# EAGLE design twometertx (EAGLE 7.3.0)
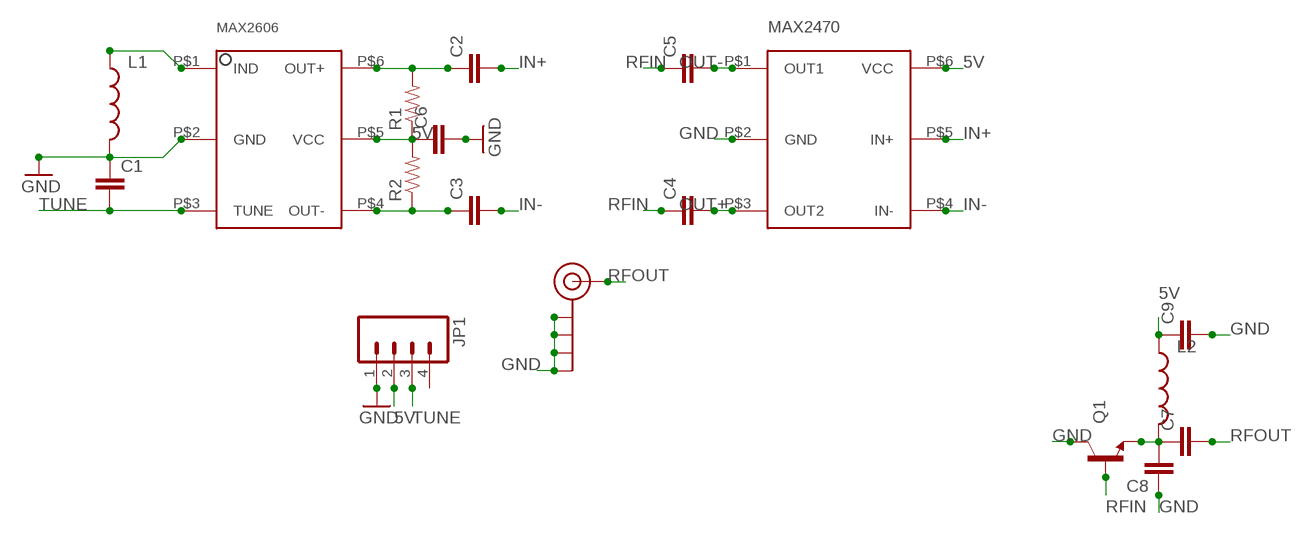
[diagram p0: schematic, sheet 1]

## Parts
C1  CAP0805  [0805]
C2  CAP0805  [0805]
C3  CAP0805  [0805]
C4  CAP0805  [0805]
C5  CAP0805  [0805]
C6  CAP0805  [0805]
C7  CAP0805  [0805]
C8  CAP0805  [0805]
C9  CAP0805  [0805]
J$1  SMA_EDGE  [SMA-EDGE]
JP1  M04LONGPADS  [1X04_LONGPADS]
L1  INDUCTOR0805  [0805]
L2  INDUCTOR0805  [0805]
Q1  TRANSISTOR_NPNSOT89  [SOT89]
R1  RESISTOR0805-RES  [0805]
R2  RESISTOR0805-RES  [0805]
U$1  MAX2606  [MAX2606]
U$2  MAX2470  [MAX2470]

## Nets
5V: C6.1 C9.1 JP1.2 L2.1 R1.1 R2.2 U$1.P$5(VCC) U$2.P$6(VCC)
GND: C1.1 C6.2 C8.1 C9.2 J$1.GND@0(GND) J$1.GND@1(GND) J$1.GND@2(GND) J$1.GND@3(GND) JP1.1 L1.2 Q1.2(C) U$1.P$2(GND) U$2.P$2(GND)
IN+: C2.2 U$2.P$5(IN+)
IN-: C3.2 U$2.P$4(IN-)
N$2: L1.1 U$1.P$1(IND)
N$3: C7.1 C8.2 L2.2 Q1.3(E)
OUT+: C4.2 U$2.P$3(OUT2)
OUT-: C5.2 U$2.P$1(OUT1)
RFIN: C4.1 C5.1 Q1.1(B)
RFOUT: C7.2 J$1.SIG(SIGNAL)
THING: C2.1 R1.2 U$1.P$6(OUT+)
THING2: C3.1 R2.1 U$1.P$4(OUT-)
TUNE: C1.2 JP1.3 U$1.P$3(TUNE)
Unconnected: JP1.4

## Library data of the parts
C1-C9 = SparkFun-Capacitors:CAP: Capacitor Standard 0603 ceramic capacitor, and 0.1" leaded capacitor.
J$1 = SparkFun-Connectors:SMA_EDGE: SMA Antenna Connector End launch SMA connector. The paste layer has been removed so that the connector can be hand soldered onto the board after reflow.
JP1 = SparkFun-Connectors:M04: Header 4 Standard 4-pin 0.1" header. Use with straight break away headers (SKU : PRT-00116), right angle break away headers (PRT-00553), swiss pins (PRT-00743), machine pins (PRT-00117), and female headers (PRT-00115). Molex polarized connector foot print use with SKU : PRT-08231 with associated crimp pins and housings. 1MM SMD Version SKU: PRT-10208
L1 L2 = SparkFun-Passives:INDUCTOR: Inductors Basic Inductor/Choke - 0603 and 1206. Footprints are not proven and vary greatly between part numbers. SRN6045- 33uH, 20% 1.4A SDR0403-560KL - 56uH, 10%, 500mA RMS/740mA peak
Q1 = SparkFun-DiscreteSemi:TRANSISTOR_NPN: Generic NPN BJT MMBT2222A - TRANS-08049 (SOT-23, 1A 40V) MPSA42 - TRANS-09116 (SOT-23, 500mA 300V) MMBT5088LT1G - TRANS-11160 (SOT-23, 50 mA 30V) BC547 - COM-08928 <http://www.sparkfun.com/products/8928> (TO-92 45V 100mA) (1.Collector 2.Base 3.Emitter) 2N3904 - COM-00521 <http://www.sparkfun.com/products/521> (TO-92 40V 200mA) (1.Emitter 2.Base 3.Collector) P2N2222A - COM-12852 <http://www.sparkfun.com/products/12852> (TO-92 40V 600mA) (1.Collector 2.Base 3.Emitter)
R1 R2 = SparkFun-Passives:RESISTOR: Resistor Basic schematic elements and footprints for 0603, 1206, and PTH resistors.
U$1 = MAX2606:MAX2606: MAX2606 RF transmitter in SOT 23-6 package
U$2 = MAX2470:MAX2470

## Board
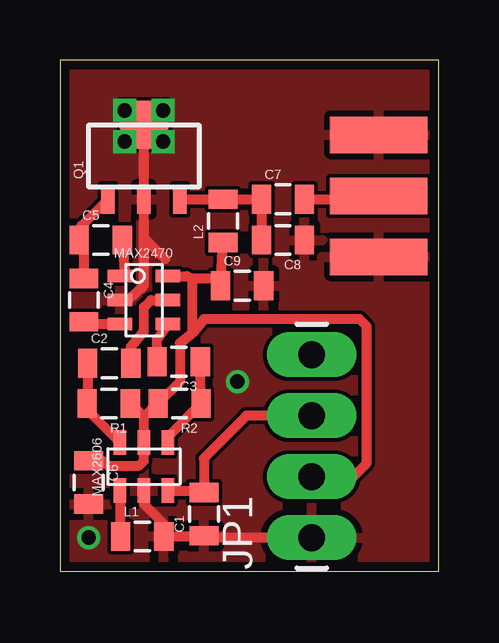
[diagram p1: board, top side]
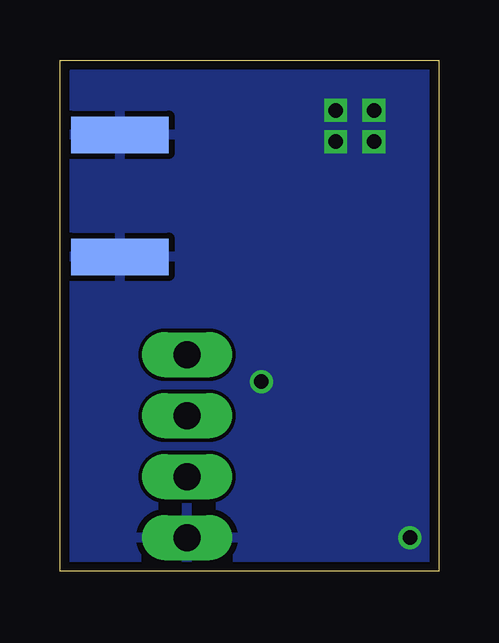
[diagram p2: board, bottom side, seen from below]

Size 15.8 x 21.3 mm. Coordinates in mm from the lower left corner, seen from the top.
Outline: 0,0 15.8,0 15.8,21.3 0,21.3 0,0
Copper layers (1*16): Top 0.0356mm / dielectric 1.5011mm / Bottom 0.0356mm
Design rules "oshpark-2layer": minimum track width 6mil, minimum drill 13mil, track to track 6mil, track to pad 6mil, pad to pad 6mil, via to via 6mil, smd to smd 6mil, copper to edge 15mil, drill to drill 6mil, minimum pad ring 7mil, minimum via ring 7mil, stop-mask expansion 4mil, vias tented up to drill 0mil, thermal gap 10mil

### Footprints (pad centres in the part's own frame; a part is rotated, then mirrored left to right if it is on the bottom)
0805 = smd 0.8 x 1.2: 1 -0.9,0; 2 0.9,0
SMA-EDGE = smd 1.524 x 4.064: GND@0 0,0; GND@1 5.08,0; SIG 2.54,0 | smd 1.524 x 4.064 bottom: GND@2 0,0; GND@3 5.08,0
1X04_LONGPADS = drill 1.118 pad 1.88 long: 1 0,0; 2 2.54,0; 3 5.08,0; 4 7.62,0
SOT89 = smd 0.58 x 1.2: 1 -1.5,-1.8; 2 0,-1.8; 3 1.5,-1.8 | smd 2 x 2: 4 0,1.3
MAX2606 = smd 0.508 x 1.016: P$1 -1,-1; P$2 0,-1; P$3 1,-1; P$4 1,1; P$5 0,1; P$6 -1,1
MAX2470 = smd 0.508 x 1.016: P$1 -1,-1; P$2 0,-1; P$3 1,-1; P$4 1,1; P$5 0,1; P$6 -1,1

### Placement (x,y rotation side)
C1  6.01,2.38 90 top
C2  2.06,8.67 0 top
C3  4.95,8.73 180 top
C4  1,11.3 270 top
C5  1.7,13.8 0 top
C6  1.2,3.7 270 top
C7  9.3,15.5 0 top
C8  9.3,13.8 180 top
C9  7.6,11.9 0 top
J$1  13.3,13.1 90 top
JP1  10.5,1.4 90 top
L1  3.43,1.45 0 top
L2  6.8,14.6 90 top
Q1  3.5,17.3 0 top
R1  2.04,6.99 180 top
R2  4.99,6.99 180 top
U$1  3.5,4.36 0 top
U$2  3.5,11.3 270 top

### Tracks (layer width: path | path; a pad name or v marks a point on that pad's centre or on a via)
5V
  Top 0.406: 3.5,6.43 U$1.P$5 3.5,4.6 3.3,4.4 2,4.4 1.8,4.6 C6.1 | 3.5,6.43 R1.1 | 3.5,6.43 4.06,6.99 R2.2 5,7.9 5,9.5 5.5,9.9 | U$2.P$6 5.3,12.3 5.5,12.2 | 5.5,12.2 5.5,9.9 | JP1.2 12.24,3.94 12.8,4.5 12.8,10.2 12.5,10.5 6,10.5 5.5,9.9 | 5.5,12.2 6.4,12.2 C9.1 L2.1
GND  (via drill 0.6)
  Top 0.406: U$1.P$2 3.5,2.8 4.3,2 4.3,1.48 L1.2 5.98,1.45 C1.1 6.09,1.4 JP1.1 | U$2.P$2 2.8,11.3 3.5,11.9 3.5,13.9 | 3.5,13.9 Q1.2 3.5,17.7 3.8,18 | 4.4,13 3.5,13.9
  other vias: 2.7,19.2 4.3,19.2 4.3,17.9 2.7,17.9 7.4,7.9 1.2,1.4
  pour Bottom: -2.6,20.8 15.2,20.8 15.2,-2.3 -2.6,-2.3
  pour Top: -2.7,20.8 15.2,20.8 15.2,-2.3 -2.7,-2.3
IN+
  Top 0.406: C2.2 2.96,9.36 3.5,10 3.5,11 3.8,11.3 U$2.P$5
IN-
  Top 0.406: C3.2 4.05,9.65 U$2.P$4
N$2
  Top 0.406: U$1.P$1 2.5,1.48 L1.1
N$3
  Top 0.406: Q1.3 L2.2 C7.1 C8.2
OUT+
  Top 0.406: U$2.P$3 1.2,10.3 C4.2
OUT-
  Top 0.406: C5.2 2.7,12.5 U$2.P$1
RFIN
  Top 0.406: C4.1 1,13.6 C5.1 0.9,14.4 Q1.1
RFOUT
  Top 0.406: C7.2 14.76,15.5 J$1.SIG
THING
  Top 0.406: U$1.P$6 1.14,6.72 R1.2 1.16,7.01 C2.1
THING2
  Top 0.406: U$1.P$4 4.5,5.6 R2.1 5.85,7.03 C3.1
TUNE
  Top 0.406: U$1.P$3 5.93,3.36 C1.2 6,4.7 7.78,6.48 JP1.3